# EAGLE design r10.1_328_1284 (EAGLE 8.4.2)
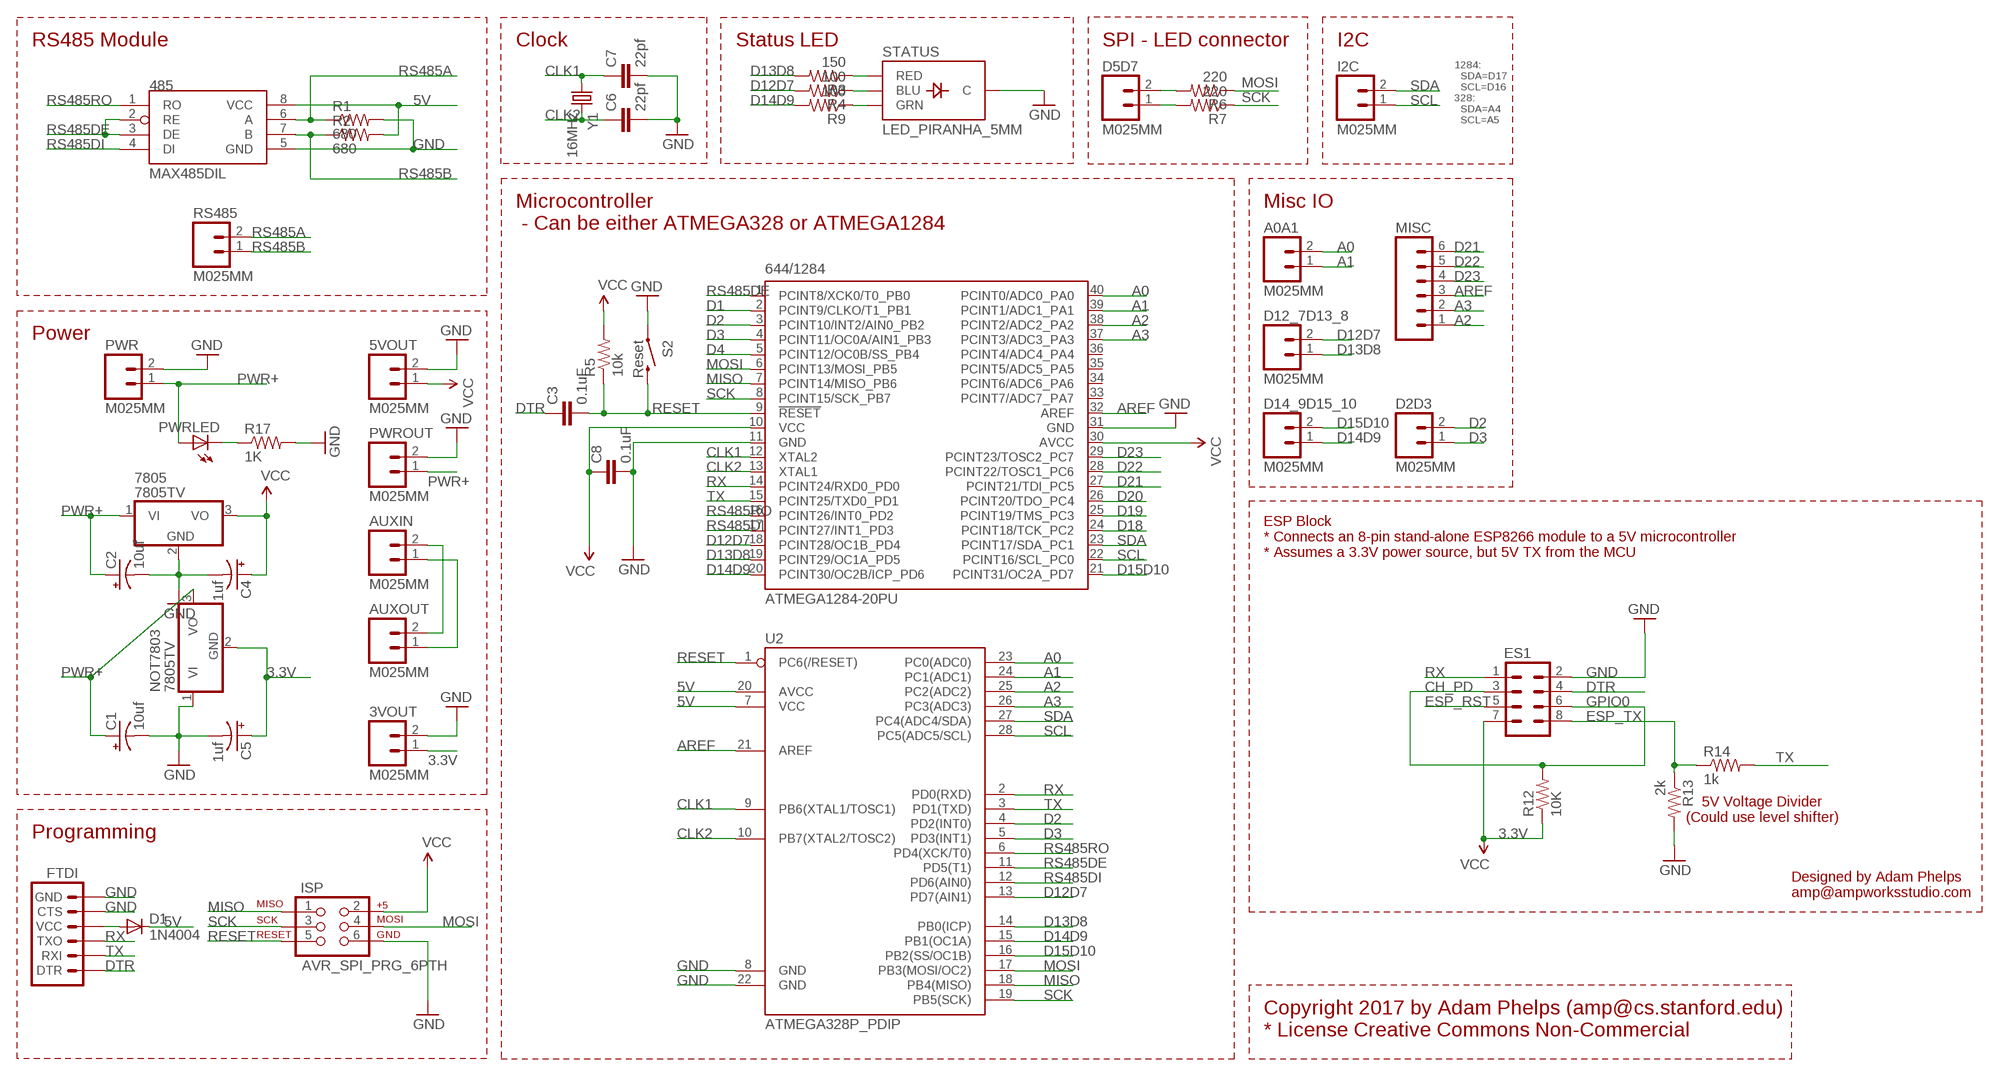
[diagram p0: schematic, sheet 1]

## Parts
3VOUT  M025MM  [SCREWTERMINAL-5MM-2]
5VOUT  M025MM  [SCREWTERMINAL-5MM-2]
485  MAX485DIL  [DIL08]
644/1284  ATMEGA1284-20PU  ATMEGA644-20PU  [DIL40]
7805  7805TV  [TO220V]
A0A1  M025MM  [SCREWTERMINAL-5MM-2]
AUXIN  M025MM  [SCREWTERMINAL-5MM-2]
AUXOUT  M025MM  [SCREWTERMINAL-5MM-2]
C1  10uf  CAP_POLPTH2  [CPOL-RADIAL-10UF-25V]
C2  10uf  CAP_POLPTH2  [CPOL-RADIAL-10UF-25V]
C3  0.1uF  CAPPTH  [CAP-PTH-SMALL]
C4  1uf  CAP_POLPTH2  [CPOL-RADIAL-10UF-25V]
C5  1uf  CAP_POLPTH2  [CPOL-RADIAL-10UF-25V]
C6  22pf  CAPPTH  [CAP-PTH-SMALL]
C7  22pf  CAPPTH  [CAP-PTH-SMALL]
C8  0.1uF  CAPPTH  [CAP-PTH-SMALL]
D1  1N4004  [DO41-10]
D2D3  M025MM  [SCREWTERMINAL-5MM-2]
D5D7  M025MM  [SCREWTERMINAL-5MM-2]
D12_7D13_8  M025MM  [SCREWTERMINAL-5MM-2]
D14_9D15_10  M025MM  [SCREWTERMINAL-5MM-2]
ES1  M04X2  [2X4]
FTDI  ARDUINO_SERIAL_PROGRAMPTH  [1X06]
I2C  M025MM  [SCREWTERMINAL-5MM-2]
ISP  AVR_SPI_PRG_6PTH  [2X3]
MISC  M06NO_SILK  [1X06_NO_SILK]
NOT7803  7805TV  [TO220V]
PWR  M025MM  [SCREWTERMINAL-5MM-2]
PWRLED  LED5MM  [LED5MM]
PWROUT  M025MM  [SCREWTERMINAL-5MM-2]
R1  680  RESISTORPTH-1/4W  [AXIAL-0.4]
R2  680  RESISTORPTH-1/4W  [AXIAL-0.4]
R3  150  RESISTORPTH-1/4W  [AXIAL-0.4]
R4  100  RESISTORPTH-1/4W  [AXIAL-0.4]
R5  10k  RESISTORPTH-1/4W  [AXIAL-0.4]
R6  220  RESISTORPTH-1/4W  [AXIAL-0.4]
R7  220  RESISTORPTH-1/4W  [AXIAL-0.4]
R9  100  RESISTORPTH-1/4W  [AXIAL-0.4]
R12  10K  1KOHM-1/4W-1%(PTH)  [AXIAL-0.3]
R13  2k  1KOHM-1/4W-1%(PTH)  [AXIAL-0.3]
R14  1k  1KOHM-1/4W-1%(PTH)  [AXIAL-0.3]
R17  1K  RESISTORPTH-1/4W  [AXIAL-0.4]
RS485  M025MM  [SCREWTERMINAL-5MM-2]
S2  Reset  SWITCH-MOMENTARY-2SMD  [TACTILE_SWITCH_SMD]
STATUS  LED_PIRANHA_5MM  [LED_PIRANHA_5MM]
U2  ATMEGA328P_PDIP  [DIL28-3]
Y1  16MHz  CRYSTALHC49US  [HC49US]

## Nets
3.3V: 3VOUT.1 C5.1(+) ES1.7 NOT7803.2(GND) R12.P$1 ; supply symbol labelled VCC
5V: 5VOUT.1 485.8(VCC) 644/1284.10(VCC) 644/1284.30(AVCC) 7805.3(VO) C4.1(+) C8.1 D1.C ISP.2 R2.P$2 R5.P$2 U2.7(VCC) U2.20(AVCC) ; supply symbol labelled VCC
A0: 644/1284.40(PCINT0/ADC0_PA0) A0A1.2 U2.23(PC0(ADC0))
A1: 644/1284.39(PCINT1/ADC1_PA1) A0A1.1 U2.24(PC1(ADC1))
A2: 644/1284.38(PCINT2/ADC2_PA2) MISC.1 U2.25(PC2(ADC2))
A3: 644/1284.37(PCINT3/ADC3_PA3) MISC.2 U2.26(PC3(ADC3))
AREF: 644/1284.32(AREF) MISC.3 U2.21(AREF)
CH_PD: ES1.3 ES1.6 R12.P$2
CLK1: 644/1284.12(XTAL2) C7.1 U2.9(PB6(XTAL1/TOSC1)) Y1.1
CLK2: 644/1284.13(XTAL1) C6.1 U2.10(PB7(XTAL2/TOSC2)) Y1.2
D1: 644/1284.2(PCINT9/CLKO/T1_PB1)
D2: 644/1284.3(PCINT10/INT2/AIN0_PB2) D2D3.2 U2.4(PD2(INT0))
D3: 644/1284.4(PCINT11/OC0A/AIN1_PB3) D2D3.1 U2.5(PD3(INT1))
D4: 644/1284.5(PCINT12/OC0B/SS_PB4)
D12D7: 644/1284.18(PCINT28/OC1B_PD4) D12_7D13_8.2 R4.P$2 U2.13(PD7(AIN1))
D13D8: 644/1284.19(PCINT29/OC1A_PD5) D12_7D13_8.1 R3.P$2 U2.14(PB0(ICP))
D14D9: 644/1284.20(PCINT30/OC2B/ICP_PD6) D14_9D15_10.1 R9.P$2 U2.15(PB1(OC1A))
D15D10: 644/1284.21(PCINT31/OC2A_PD7) D14_9D15_10.2 U2.16(PB2(SS/OC1B))
D18: 644/1284.24(PCINT18/TCK_PC2)
D19: 644/1284.25(PCINT19/TMS_PC3)
D20: 644/1284.26(PCINT20/TDO_PC4)
D21: 644/1284.27(PCINT21/TDI_PC5) MISC.6
D22: 644/1284.28(PCINT22/TOSC1_PC6) MISC.5
D23: 644/1284.29(PCINT23/TOSC2_PC7) MISC.4
DTR: C3.1 ES1.4 FTDI.DTR
ESP_RST: ES1.5
ESP_TX: ES1.8 R13.P$1 R14.P$1
GND: 3VOUT.2 5VOUT.2 485.5(GND) 644/1284.11(GND) 644/1284.31(GND) 7805.2(GND) C1.2(-) C2.2(-) C4.2(-) C5.2(-) C6.2 C7.2 C8.2 ES1.2 FTDI.CTS FTDI.GND ISP.6 NOT7803.1(VI) PWR.2 PWROUT.2 R1.P$2 R13.P$2 R17.P$2 S2.1 STATUS.-(C) U2.8(GND) U2.22(GND)
MISO: 644/1284.7(PCINT14/MISO_PB6) ISP.1 U2.18(PB4(MISO))
MOSI: 644/1284.6(PCINT13/MOSI_PB5) ISP.4 R6.P$1 U2.17(PB3(MOSI/OC2))
N$1: PWRLED.K(C) R17.P$1
N$2: AUXIN.1 AUXOUT.1
N$3: AUXIN.2 AUXOUT.2
N$4: D5D7.2 R6.P$2
N$5: R3.P$1 STATUS.R(RED)
N$6: R4.P$1 STATUS.B(BLU)
N$7: R9.P$1 STATUS.G(GRN)
N$8: D5D7.1 R7.P$2
N$9: D1.A FTDI.VCC
PWR+: 7805.1(VI) C1.1(+) C2.1(+) NOT7803.3(VO) PWR.1 PWRLED.A PWROUT.1
RESET: 644/1284.9(!RESET) C3.2 ISP.5 R5.P$1 S2.3 U2.1(PC6(/RESET))
RS485A: 485.6(A) R1.P$1 RS485.2
RS485B: 485.7(B) R2.P$1 RS485.1
RS485DE: 485.2(RE) 485.3(DE) 644/1284.1(PCINT8/XCK0/T0_PB0) U2.11(PD5(T1))
RS485DI: 485.4(DI) 644/1284.17(PCINT27/INT1_PD3) U2.12(PD6(AIN0))
RS485RO: 485.1(RO) 644/1284.16(PCINT26/INT0_PD2) U2.6(PD4(XCK/T0))
RX: 644/1284.14(PCINT24/RXD0_PD0) ES1.1 FTDI.TXO U2.2(PD0(RXD))
SCK: 644/1284.8(PCINT15/SCK_PB7) ISP.3 R7.P$1 U2.19(PB5(SCK))
SCL: 644/1284.22(PCINT16/SCL_PC0) I2C.1 U2.28(PC5(ADC5/SCL))
SDA: 644/1284.23(PCINT17/SDA_PC1) I2C.2 U2.27(PC4(ADC4/SDA))
TX: 644/1284.15(PCINT25/TXD0_PD1) FTDI.RXI R14.P$2 U2.3(PD1(TXD))
Unconnected: 644/1284.33(PCINT7/ADC7_PA7) 644/1284.34(PCINT6/ADC6_PA6) 644/1284.35(PCINT5/ADC5_PA5) 644/1284.36(PCINT4/ADC4_PA4)

## Notes on the sheet
- RS485 Module | Clock | Status LED | SPI - LED connector | I2C
- 1284:
    SDA=D17
    SCL=D16
  328:
    SDA=A4
    SCL=A5
- Microcontroller
   - Can be either ATMEGA328 or ATMEGA1284
- Misc IO
- Power
- ESP Block
  * Connects an 8-pin stand-alone ESP8266 module to a 5V microcontroller
  * Assumes a 3.3V power source, but 5V TX from the MCU
- GPIO0
- 5V Voltage Divider
  (Could use level shifter)
- Programming
- Designed by Adam Phelps
  amp@ampworksstudio.com
- Copyright 2017 by Adam Phelps (amp@cs.stanford.edu)
  * License Creative Commons Non-Commercial

## Library data of the parts
3VOUT 5VOUT A0A1 AUXIN AUXOUT D2D3 D5D7 D12_7D13_8 D14_9D15_10 I2C PWR PWROUT RS485 = SparkFun-Connectors:M02: Standard 2-pin 0.1" header. Use with - straight break away headers ( PRT-00116) - right angle break away headers (PRT-00553) - swiss pins (PRT-00743) - machine pins (PRT-00117) - female headers (PRT-00115) Molex polarized connector foot print use with: PRT-08233 with associated crimp pins and housings. 2.54_SCREWTERM for use with PRT-10571. 3.5mm Screw Terminal footprints for PRT-08084 5mm Screw Terminal footprints for use with PRT-08433
485 = SparkFun-DigitalIC:MAX485: RS-485 transceiver
644/1284 = atmel:ATMEGA644-*PU: 8-bit Microcontroller with 64K Bytes In-System Programmable Flash Auto generated by make-symbol-device-package-bsdl.ulp Rev. 34 Source: http://www.atmel.com/dyn/resources/prod_documents/doc2593.pdf; MPN: ATMEGA644-20PU; OC_FARNELL: 1288340; OC_NEWARK: 23M5060
7805 NOT7803 = linear:78*: Positive VOLTAGE REGULATOR Source: http://cache.national.com/ds/LM/LM78L05.pdf http://www.fairchildsemi.com/ds/LM/LM7805.pdf
C1 C2 C4 C5 = SparkFun-Capacitors:CAP_POL: Capacitor Polarized These are standard SMD and PTH capacitors. Normally 10uF, 47uF, and 100uF in electrolytic and tantalum varieties. Always verify the external diameter of the through hole cap, it varies with capacity, voltage, and manufacturer. The EIA devices should be standard.
C3 C6-C8 = SparkFun-Capacitors:CAP: Capacitor Standard 0603 ceramic capacitor, and 0.1" leaded capacitor.
D1 = adafruit:1N4004: DIODE General purpose 1N400x type rectifier (With bigger pads) http://www.ladyada.net/library/pcb/eaglelibrary.html
ES1 = SparkFun-Connectors:M04X2: .1" header, two rows of four.
FTDI = SparkFun-Connectors:ARDUINO_SERIAL_PROGRAM: FTDI connector footprints
ISP = SparkFun-Connectors:AVR_SPI_PRG_6: AVR ISP 6 Pin This is the reduced ISP connector for AVR programming. Common on Arduino. This footprint will take up less PCB space and can be used with a 10-pin to 6-pin adapter such as SKU: BOB-08508
MISC = SparkFun-Connectors:M06: Header 6 Standard 6-pin 0.1" header. Use with straight break away headers (SKU : PRT-00116), right angle break away headers (PRT-00553), swiss pins (PRT-00743), machine pins (PRT-00117), and female headers (PRT-00115). Molex polarized connector foot print use with SKU : PRT-08094 with associated crimp pins and housings. NOTES ON THE VARIANTS LOCK and LOCK_LONGPADS... This footprint was designed to help hold the alignment of a through-hole component (i.e. 6-pin header) while soldering it into place. You may notice that each hole has been shifted either up or down by 0.005 of an inch from it's more standard position (which is a perfectly straight line). This slight alteration caused the pins (the squares in the middle) to touch the edges of the holes. Because they are alternating, it causes a "brace" to hold the component in place. 0.005 has proven to be the perfect amount of "off-center" position when using our standard breakaway headers. Although looks a little odd when you look at the bare footprint, once you have a header in there, the alteration is very hard to notice. Also,if you push a header all the way into place, it is covered up entirely on the bottom side. This idea of altering the position of holes to aid alignment will be further integrated into the Sparkfun Library for other footprints. It can help hold any component with 3 or more connection pins.
PWRLED = SparkFun-LED:LED: LEDs Standard schematic elements and footprints for 5mm, 3mm, 1206, and 0603 sized LEDs. 5mm - Spark Fun Electronics SKU : COM-00529 (and others)
R1 R2 R17 = SparkFun-Resistors:RESISTOR: Resistor Basic schematic elements and footprints for 0603, 1206, and PTH resistors.
R3-R7 R9 = SparkFun-Passives:RESISTOR: Resistor Basic schematic elements and footprints for 0603, 1206, and PTH resistors.
R12-R14 = SparkFun-Resistors:1KOHM-1/4W-1%(PTH): RES-12182; PROD_ID: RES-12182; VALUE: 1K
S2 = SparkFun:SWITCH-MOMENTARY-2
STATUS = SparkFun-LED:LED_PIRANHA_5MM: High-brightness RGB through-hole LED, similar to that used in the Shiftbrite
U2 = SparkFun-DigitalIC:ATMEGA328P_PDIP: uC used in the Arduino 32kb flash, 1k EEPROM, 2k SRAM This is the through-hole version of this chip.
Y1 = SparkFun-FreqCtrl:CRYSTAL: Various standard crystals. Proven footprints. Spark Fun Electronics SKU : COM-00534

## Net classes
0 default: width 0.203 mm

## Board
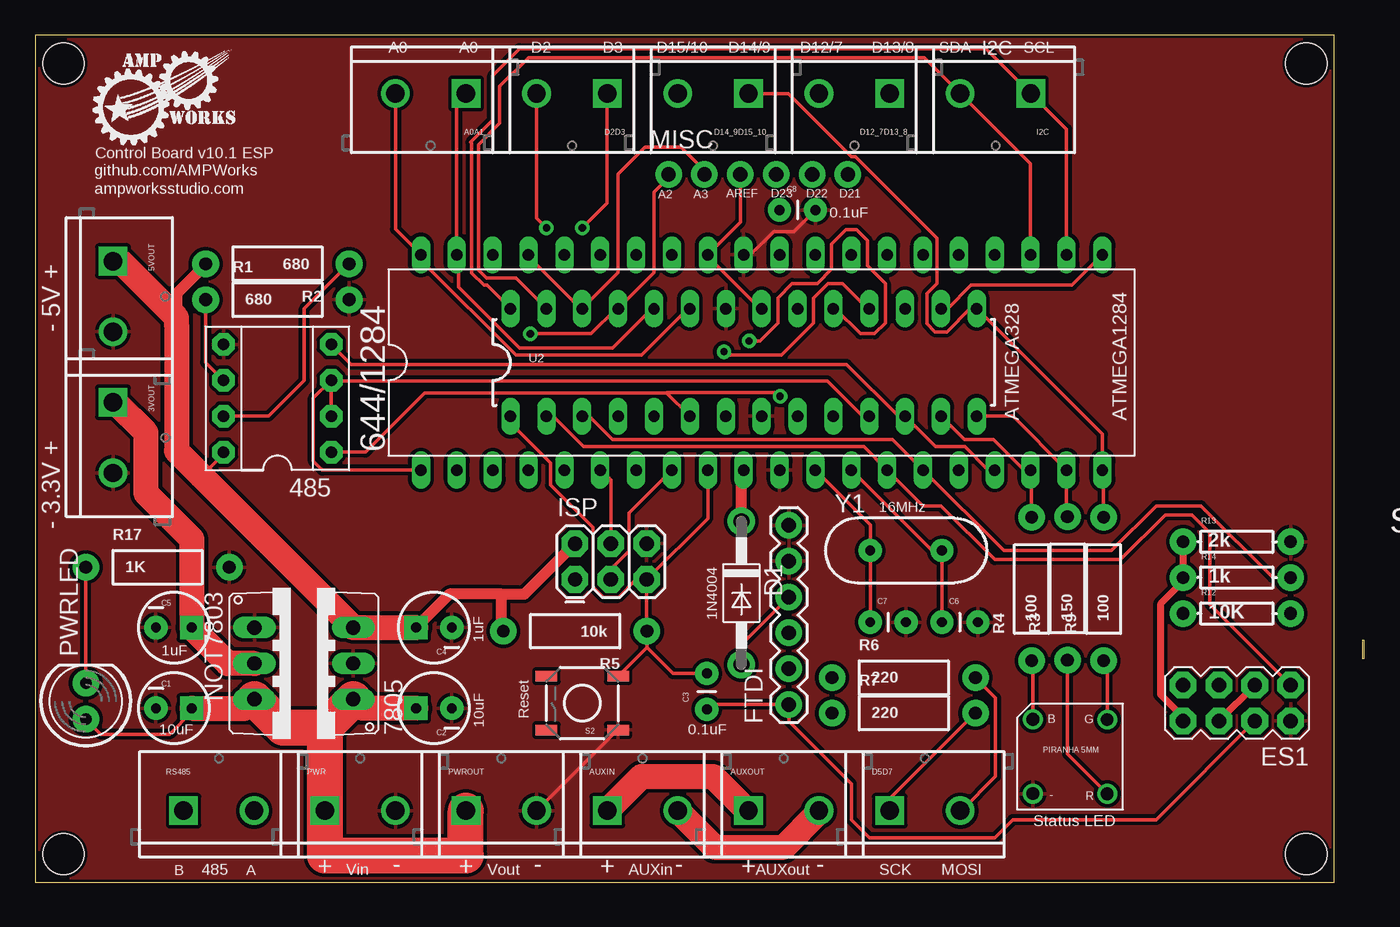
[diagram p1: board, top side]
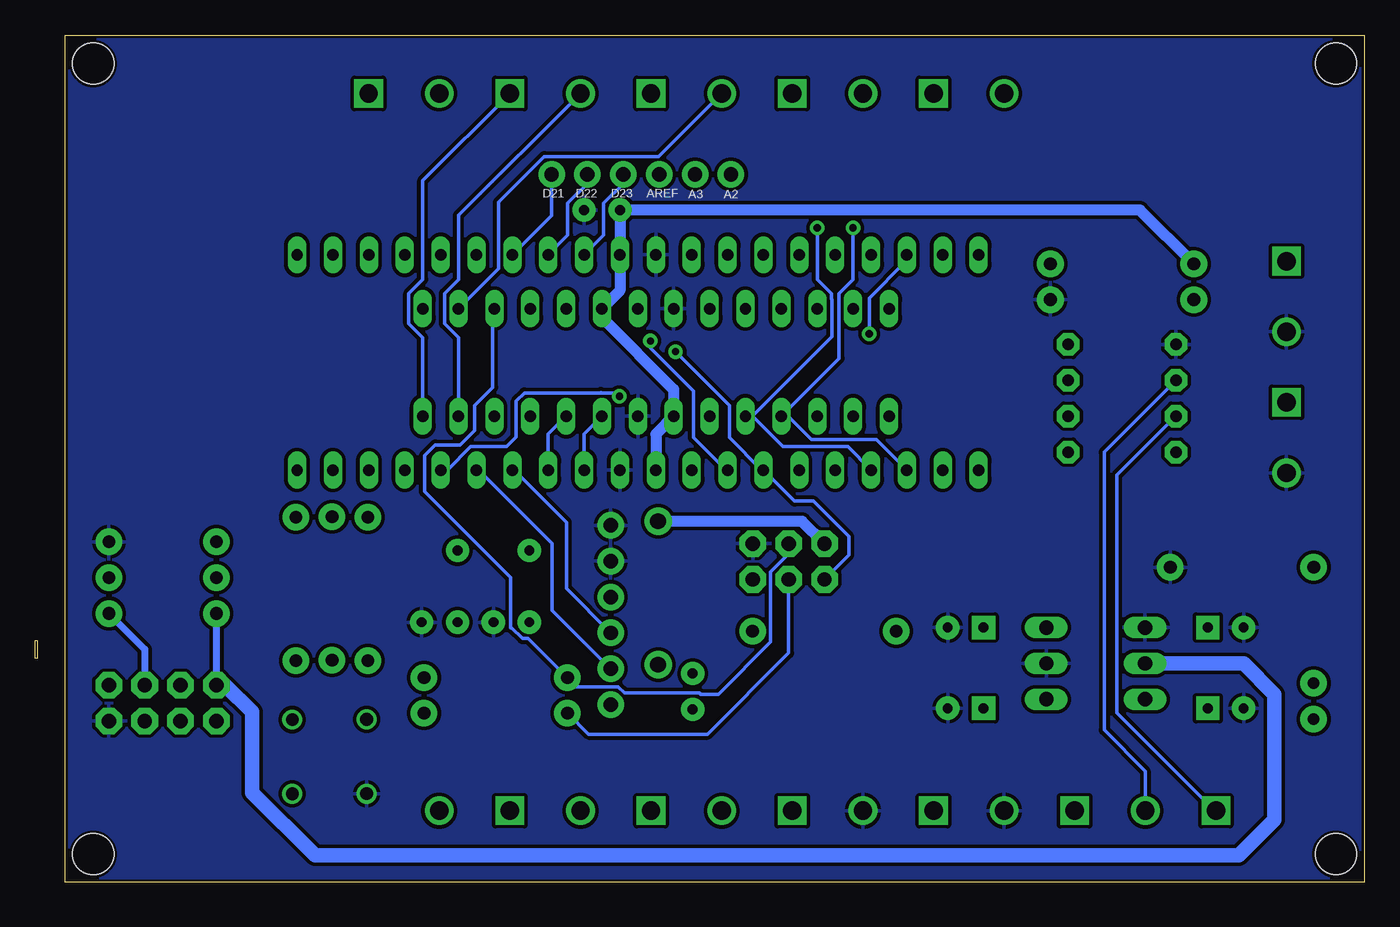
[diagram p2: board, bottom side, seen from below]

Size 94.11 x 60 mm. Coordinates in mm from the lower left corner, seen from the top.
Outline: 0,0 92,0 92,60 0,60 0,0
Copper layers (1*16): Top 0.035mm / dielectric 1.5mm / Bottom 0.035mm
Design rules "SparkFun-2-layer-STANDARD": minimum track width 10mil, minimum drill 20mil, track to track 10mil, track to pad 8mil, pad to pad 8mil, via to via 10mil, smd to smd 8mil, copper to edge 8mil, drill to drill 8mil, minimum pad ring 10mil, minimum via ring 10mil, stop-mask expansion 4mil, vias tented up to drill 25mil, thermal gap 10mil
Holes 2.92 mm at 2,58 90,58 90,2 2,2

### Footprints (pad centres in the part's own frame; a part is rotated, then mirrored left to right if it is on the bottom)
SCREWTERMINAL-5MM-2 = drill 1.3 pad 2.032 square: 1 0,0 | drill 1.3 pad 2.032: 2 5,0
DIL08 = drill 0.813 pad 1.6 octagon: 1 -3.81,-3.81; 2 -1.27,-3.81; 3 1.27,-3.81; 4 3.81,-3.81; 5 3.81,3.81; 6 1.27,3.81; 7 -1.27,3.81; 8 -3.81,3.81
DIL40 = drill 0.813 long: 1 -24.13,-7.62; 2 -21.59,-7.62; 3 -19.05,-7.62; 4 -16.51,-7.62; 5 -13.97,-7.62; 6 -11.43,-7.62; 7 -8.89,-7.62; 8 -6.35,-7.62; 9 -3.81,-7.62; 10 -1.27,-7.62; 11 1.27,-7.62; 12 3.81,-7.62; 13 6.35,-7.62; 14 8.89,-7.62; 15 11.43,-7.62; 16 13.97,-7.62; 17 16.51,-7.62; 18 19.05,-7.62; 19 21.59,-7.62; 20 24.13,-7.62; 21 24.13,7.62; 22 21.59,7.62; 23 19.05,7.62; 24 16.51,7.62; 25 13.97,7.62; 26 11.43,7.62; 27 8.89,7.62; 28 6.35,7.62; 29 3.81,7.62; 30 1.27,7.62; 31 -1.27,7.62; 32 -3.81,7.62; 33 -6.35,7.62; 34 -8.89,7.62; 35 -11.43,7.62; 36 -13.97,7.62; 37 -16.51,7.62; 38 -19.05,7.62; 39 -21.59,7.62; 40 -24.13,7.62
TO220V = drill 1.016 long: 1 -2.54,-2.54; 2 0,-2.54; 3 2.54,-2.54
CPOL-RADIAL-10UF-25V = drill 0.7 pad 1.651 square: 1 1.27,0 | drill 0.7 pad 1.651: 2 -1.27,0
CAP-PTH-SMALL = drill 0.7 pad 1.651: 1 0,0; 2 2.54,0
DO41-10 = drill 1.118 pad 1.93: A 5.08,0; C -5.08,0
2X4 = drill 1.016 pad 1.88 octagon: 1 -3.81,-1.27; 2 -3.81,1.27; 3 -1.27,-1.27; 4 -1.27,1.27; 5 1.27,-1.27; 6 1.27,1.27; 7 3.81,-1.27; 8 3.81,1.27
1X06 = drill 1.016 pad 1.88: CTS 10.16,0; DTR 0,0; GND 12.7,0; RXI 2.54,0; TXO 5.08,0; VCC 7.62,0
2X3 = drill 1.016 pad 1.88 octagon: 1 0,0; 2 0,2.54; 3 2.54,0; 4 2.54,2.54; 5 5.08,0; 6 5.08,2.54
1X06_NO_SILK = drill 1.016 pad 1.88: 1 0,0; 2 2.54,0; 3 5.08,0; 4 7.62,0; 5 10.16,0; 6 12.7,0
LED5MM = drill 0.813 pad 1.88: A -1.27,0; K 1.27,0
AXIAL-0.4 = drill 0.9 pad 1.88: P$1 -5.08,0; P$2 5.08,0
AXIAL-0.3 = drill 0.9 pad 1.88: P$1 -3.81,0; P$2 3.81,0
TACTILE_SWITCH_SMD = smd 1.524 x 0.762: 1 -2.54,1.905; 2 2.54,1.905; 3 -2.54,-1.905; 4 2.54,-1.905
LED_PIRANHA_5MM = drill 0.9: - -2.684,-2.684; B -2.688,2.574; G 2.575,2.562; R 2.579,-2.696
DIL28-3 = drill 0.813 long: 1 -16.51,-3.81; 2 -13.97,-3.81; 3 -11.43,-3.81; 4 -8.89,-3.81; 5 -6.35,-3.81; 6 -3.81,-3.81; 7 -1.27,-3.81; 8 1.27,-3.81; 9 3.81,-3.81; 10 6.35,-3.81; 11 8.89,-3.81; 12 11.43,-3.81; 13 13.97,-3.81; 14 16.51,-3.81; 15 16.51,3.81; 16 13.97,3.81; 17 11.43,3.81; 18 8.89,3.81; 19 6.35,3.81; 20 3.81,3.81; 21 1.27,3.81; 22 -1.27,3.81; 23 -3.81,3.81; 24 -6.35,3.81; 25 -8.89,3.81; 26 -11.43,3.81; 27 -13.97,3.81; 28 -16.51,3.81
HC49US = drill 0.7 pad 1.651: 1 -2.54,0; 2 2.54,0

### Placement (x,y rotation side)
3VOUT  5.5,34 270 top
5VOUT  5.5,44 270 top
485  17.14,34.29 90 top
644/1284  51.44,36.83 0 top
7805  19.97,15.51 90 top
A0A1  30.5,55.88 180 top
AUXIN  40.5,5.08 0 top
AUXOUT  50.5,5.08 0 top
C1  9.81,12.34 0 top
C2  28.23,12.34 180 top
C3  47.55,12.26 90 top
C4  28.23,18.05 180 top
C5  9.81,18.05 0 top
C6  64.2,18.43 0 top
C7  59.12,18.43 0 top
C8  52.7,47.62 0 top
D1  50,20.5 270 top
D2D3  40.5,55.88 180 top
D5D7  60.5,5.08 0 top
D12_7D13_8  60.5,55.88 180 top
D14_9D15_10  50.5,55.88 180 top
ES1  85.09,12.7 180 top
FTDI  53.36,12.6 90 top
I2C  70.5,55.88 180 top
ISP  38.22,21.46 0 top
MISC  44.84,50.14 0 top
NOT7803  18.07,15.51 270 top
PWR  20.5,5.08 0 top
PWRLED  3.58,12.84 90 top
PWROUT  30.5,5.08 0 top
R1  17.14,41.27 0 top
R2  17.14,43.81 180 top
R3  73.09,20.83 90 top
R4  70.55,20.79 90 top
R5  38.23,17.8 180 top
R6  61.5,14.5 0 top
R7  61.5,12 0 top
R9  75.65,20.79 90 top
R12  85.09,19.05 0 top
R13  85.09,24.13 0 top
R14  85.09,21.59 0 top
R17  8.65,22.32 0 top
RS485  10.5,5.08 0 top
S2  38.73,12.7 180 top
STATUS  73.33,8.97 0 top
U2  50.16,36.83 0 top
Y1  61.66,23.51 0 top

### Tracks (layer width: path | path; a pad name or v marks a point on that pad's centre or on a via)
3.3V
  Top 1.778: 3VOUT.1 5.7,34 7.85,31.85 7.85,27.55 11.1,24.3 11.1,18.07 C5.1 13.62,15.51 NOT7803.2
  Bottom 0.508: ES1.7 R12.P$1
  Bottom 1.016: NOT7803.2 8.53,15.51 6.35,13.34 6.35,4.45 8.89,1.91 74.3,1.91 78.74,6.35 78.74,12.06 80.64,13.97 ES1.7
5V
  Top 0.254: 485.8 13.34,30.34 11.78,28.78 | R2.P$2 12.06,43.77
  Top 0.762: 12.06,43.77 10,41.7 10,39.5 | D1.C 50,29.05 644/1284.10 | ISP.2 34.64,20.42 33.02,20.42 | C4.1 29.32,20.42 33.02,20.42 | R5.P$2 33.02,17.93 33.02,20.42
  Top 1.778: C4.1 7805.3 11.78,28.78 10,30.56 10,39.5 10,40 6,44 5VOUT.1
  Bottom 0.762: R2.P$2 15.88,47.62 C8.1 644/1284.30 52.7,41.91 U2.20 53.98,40.01 48.9,34.92 U2.7 50.16,31.75 644/1284.10 | ISP.2 39.8,25.58 D1.C
A0
  Top 0.254: A0A1.2 25.5,46.26 644/1284.40 27.43,44.45 27.43,43.94 34.04,37.34 42.93,37.34 46.23,40.64 U2.23
A1
  Top 0.254: A0A1.1 29.84,55.23 644/1284.39 29.97,44.45 29.97,42.16 34.29,37.85 40.89,37.85 43.69,40.64 U2.24
A2  (via drill 0.51)
  Top 0.254: v35.05,38.86 39.37,38.86 41.15,40.64 U2.25 43.81,43.18 43.81,48.9 44.84,49.92 MISC.1
  Bottom 0.254: v35.05,38.86 35.05,41.4 32.51,43.94 32.51,44.45 644/1284.38
A3
  Top 0.254: 644/1284.37 34.8,44.45 38.61,40.64 U2.26 41.27,43.18 41.27,50.16 43.18,52.07 45.72,52.07 47.38,50.41 MISC.2
AREF
  Top 0.254: U2.21 51.31,40.64 47.5,44.45 644/1284.32 49.92,46.75 MISC.3
CH_PD
  Top 0.508: ES1.3 ES1.6
  Bottom 0.508: R12.P$2 86.36,16.51 ES1.3
CLK1
  Top 0.254: C7.1 Y1.1 59.12,25.33 644/1284.12
  Bottom 0.254: U2.9 55.24,31.75 644/1284.12
CLK2
  Top 0.254: C6.1 Y1.2 63.48,23.51 644/1284.13
  Bottom 0.254: U2.10 57.78,31.75 644/1284.13
D2  (via drill 0.51)
  Top 0.254: v36.2,46.35 35.5,47.05 D2D3.2
  Bottom 0.254: 644/1284.3 34.54,31.37 39.15,31.37 40.8,33.02 U2.4 37.19,37.11 37.19,41.71 36.2,42.7 v36.2,46.35
D3  (via drill 0.51)
  Top 0.254: v38.73,46.35 40.5,48.12 D2D3.1
  Bottom 0.254: 644/1284.4 36.58,30.86 41.18,30.86 43.34,33.02 | U2.5 43.34,33.02 | 43.34,33.02 37.69,38.66 37.69,41.27 37.74,41.33 37.74,41.71 38.73,42.7 v38.73,46.35
D12D7
  Top 0.254: R4.P$2 70.55,29.14 644/1284.18 70.01,29.21 67.85,31.37 65.79,31.37 U2.13
  Bottom 0.254: D12_7D13_8.2 64.14,47.24 64.14,42.7 65.13,41.71 65.13,39.57 64.14,38.58 U2.13
D13D8
  Top 0.254: R3.P$2 73.03,25.98 644/1284.19 69.22,33.02 U2.14
  Bottom 0.254: D12_7D13_8.1 66.67,49.7 66.67,42.7 67.67,41.71 67.67,39.57 66.67,38.58 U2.14
D14D9
  Top 0.254: R9.P$2 75.65,29.12 644/1284.20 75.56,31.75 U2.15 66.2,40.64 64.55,38.99 63.73,38.99 63.14,39.57 63.14,41.71 63.86,42.42 63.86,45.62 58.07,51.41 57.81,51.41 53.34,55.88 D14_9D15_10.1
D15D10
  Top 0.254: U2.16 64.61,40.64 66.27,42.29 73.41,42.29 644/1284.21
  Bottom 0.254: D14_9D15_10.2 49.97,51.41 58.07,51.41 61.32,48.16 61.32,43.46 U2.16
D21
  Bottom 0.254: 644/1284.27 57.55,47.23 MISC.6
D22
  Bottom 0.254: 644/1284.28 56.4,45.83 56.4,48.1 55.01,49.5 MISC.5
D23
  Bottom 0.254: MISC.4 52.47,49.5 53.86,48.1 53.86,45.83 644/1284.29
DTR
  Top 0.254: C3.1 47.89,12.6 FTDI.DTR 53.36,11.41 57.78,6.99 57.78,4.45 59.05,3.17 67.94,3.17 69.22,4.45 79.38,4.45 ES1.4
ESP_TX
  Top 0.508: R13.P$1 R14.P$1 81.28,21.3 79.69,19.71 79.69,13.31 81.28,11.72 ES1.8
GND
  Top 0.254: PWROUT.2 41.22,10.79 S2.1 | 644/1284.31 50.64,44.45 52.3,46.1 53.72,46.1 C8.2
  pour Bottom: 0,60 92.06,60 92.08,0 0,0
  pour Top: 0,0 0,60.33 92.71,60.33 92.08,0
MISO  (via drill 0.51)
  Top 0.254: v48.77,37.59 49.02,37.34 52.83,37.34 55.12,39.62 55.12,41.4 56.13,42.42 57.15,42.42 58.93,40.64 U2.18
  Bottom 0.254: ISP.1 36.5,23.18 36.5,24.5 39,27 40.34,27 644/1284.7 42.67,29.21 44.96,31.5 44.96,33.78 v48.77,37.59
MOSI
  Top 0.254: 644/1284.6 40.05,29.21 40.76,28.5 ISP.4
  Bottom 0.254: ISP.4 40.76,23.26 42.03,21.99 42.03,17.02 45.72,13.34 47,13.34 47.08,13.42 52.38,13.42 52.83,13.87 55.78,13.87 R6.P$1 59.19,17.27 59.6,17.27 60.36,18.03 60.45,18.03 60.45,21.59 66.55,27.69 66.55,30.23 65.79,30.99 64.01,30.99 62.99,32 62.99,33.78 61.72,35.05 61.72,40.64 U2.17
N$1
  Top 0.254: PWRLED.K R17.P$1
N$2
  Top 1.778: AUXIN.1 42.92,7.5 48,7.5 50.42,5.08 AUXOUT.1
N$3
  Top 1.778: AUXIN.2 48.08,2.5 53,2.5 55.5,5 AUXOUT.2
N$4
  Top 0.254: R6.P$2 68,13.08 68,7.5 65.58,5.08 D5D7.2
N$5
  Top 0.254: R3.P$1 73.09,9.09 STATUS.R
N$6
  Top 0.254: R4.P$1 70.64,15.61 STATUS.B
N$7
  Top 0.254: STATUS.G 75.91,15.45 R9.P$1
N$8
  Top 0.254: R7.P$2 60.5,5.92 D5D7.1
N$9
  Top 0.254: D1.A 50,16.86 FTDI.VCC
PWR+
  Top 0.254: C1.1 11.08,12.08 9.5,10.5 4.64,10.5 PWRLED.A
  Top 1.778: C2.1 23.14,12.34 7805.1 | C1.1 14.89,12.34 NOT7803.3
  Top 2.54: 20.5,10.96 PWR.1 20.5,1.91 30.48,1.91 30.48,5.08 PWROUT.1 | 20.5,10.96 7805.1 | 20.5,10.96 17.54,10.96 NOT7803.3
RESET
  Top 0.254: ISP.5 47.62,25.79 644/1284.9 | 43.31,16.64 S2.3 | 43.31,16.64 R5.P$1 ISP.5 | 43.31,16.64 45.16,14.8 C3.2 | U2.1 33.66,32.54 36.47,29.72 36.47,28.14 39.49,25.12 39.49,20.93 40.23,20.19 41.29,20.19 42.56,21.46 ISP.5
RS485A
  Top 0.254: R1.P$1 12.06,36.83 485.6
  Bottom 0.254: 485.6 18.41,30.48 18.41,10.79 15.5,7.88 RS485.2
RS485B
  Top 0.254: 485.7 16.51,33.02 19.05,35.56 19.05,40.64 R2.P$1
  Bottom 0.254: RS485.1 10.58,5.08 17.5,12 17.5,28.86 485.7
RS485DE
  Top 0.254: 485.3 485.2 | 644/1284.1 20.32,29.21 19.68,29.84 19.68,34.29 485.3 | U2.11 58.58,33.02 56.08,35.52 21,35.52 485.3
RS485DI
  Top 0.254: 644/1284.17 67.47,29.21 65.81,30.86 63.75,30.86 U2.12 61.12,33.02 57.45,36.69 22.36,36.69 485.4
RS485RO  (via drill 0.51 pad 0.51)
  Top 0.254: 44.7,34.67 U2.6 | 44.7,34.67 33.24,34.67 33.24,34.66 27.57,34.66 23.39,30.48 485.1 | 44.7,34.67 44.74,34.71 52.47,34.71 v52.74,34.43
  Bottom 0.254: 54.05,34.71 54.09,34.67 | 644/1284.16 64.93,29.21 63.27,30.86 60.73,30.86 60.05,31.55 60.05,34.09 59.47,34.67 54.09,34.67 | v52.74,34.43 52.98,34.67 54.09,34.67
RX
  Top 0.254: U2.2 36.67,33.02 38.83,30.86 58.67,30.86 644/1284.14 62.87,26.67 64.14,26.67 67.94,22.86 76.83,22.86 80.01,26.04 81.92,26.04 83.19,24.77 83.19,19.68 ES1.1
  Bottom 0.254: 644/1284.14 60.21,29.21 56.5,25.5 56.5,20.82 FTDI.TXO
SCK  (via drill 0.51)
  Top 0.254: ISP.3 40.76,22.2 42.03,23.47 42.03,26.16 644/1284.8 | v50.55,38.35 51.31,38.35 52.58,39.62 52.58,41.4 53.59,42.42 55.37,42.42 56.39,43.43 56.39,45.21 57.4,46.23 58.17,46.23 58.93,45.47 58.93,43.69 60.2,42.42 60.2,39.62 59.44,38.86 58.42,38.86 56.64,40.64 U2.19
  Bottom 0.254: R7.P$1 54.92,10.5 46.5,10.5 40.76,16.24 ISP.3 | v50.55,38.35 50.55,37.85 47.5,34.8 47.5,31.5 45.21,29.21 644/1284.8
SCL
  Top 0.254: 644/1284.22 73.03,53.35 I2C.1 67.33,59.05 34.29,59.05 32.38,57.15 32.38,53.98 30.84,52.43 30.89,52.38 30.89,43.17 31.76,42.29 32,42.29 U2.28
SDA
  Top 0.254: 644/1284.23 70.48,50.9 I2C.2 62.96,58.42 34.92,58.42 32.89,56.39 32.89,53.77 31.39,52.27 31.39,43.38 31.98,42.8 34.04,42.8 U2.27
TX
  Top 0.254: U2.3 39.21,33.02 40.87,31.37 60.71,31.37 644/1284.15 68.58,23.5 76.2,23.5 79.38,26.67 82.55,26.67 87.63,21.59 R14.P$2
  Bottom 0.254: 644/1284.15 62.71,29.21 57.5,24 57.5,19.27 FTDI.RXI

### Text on the board
tPlace: A0 | A0 | D2 | D3 | D15/10 | D14/9 | D12/7 | D13/8 | SDA | I2C | SCL | Control Board v10.1 ESP | github.com/AMPWorks | ampworksstudio.com | AREF | D23 | D22 | D21 | A2 | A3 | 0.1uF | - 5V + | ATMEGA328 | ATMEGA1284 | 16MHz | - 3.3V + | 1uF | 1N4004 | 1uF | Reset | 10uF | 10uF | 0.1uF | Status LED | - | - | - | - | B | 485 | A | + | Vin | + | Vout | + | AUXin | + | AUXout | SCK | MOSI
bPlace: AREF | D23 | D22 | D21 | A2 | A3
tNames: Should ESP Reset via cap like FTDI?